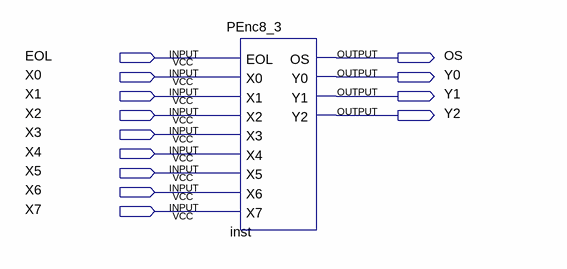
[diagram p0: schematic sheet]
// Quartus schematic EncoderDemo.bdf as structural Verilog: 1 symbols, 13 pins
module EncoderDemo (
  input  EOL,
  input  X0,
  input  X1,
  input  X2,
  input  X3,
  input  X4,
  input  X5,
  input  X6,
  input  X7,
  output OS,
  output Y0,
  output Y1,
  output Y2
);

  PEnc8_3 inst (
    .EOL(EOL), .X0(X0), .X1(X1), .X2(X2), .X3(X3), .X4(X4), .X5(X5), .X6(X6), .X7(X7), .OS(OS), .Y0(Y0),
    .Y1(Y1), .Y2(Y2));
endmodule
